# Altium project Prototype_1.PrjPcb (part 2 of 2)
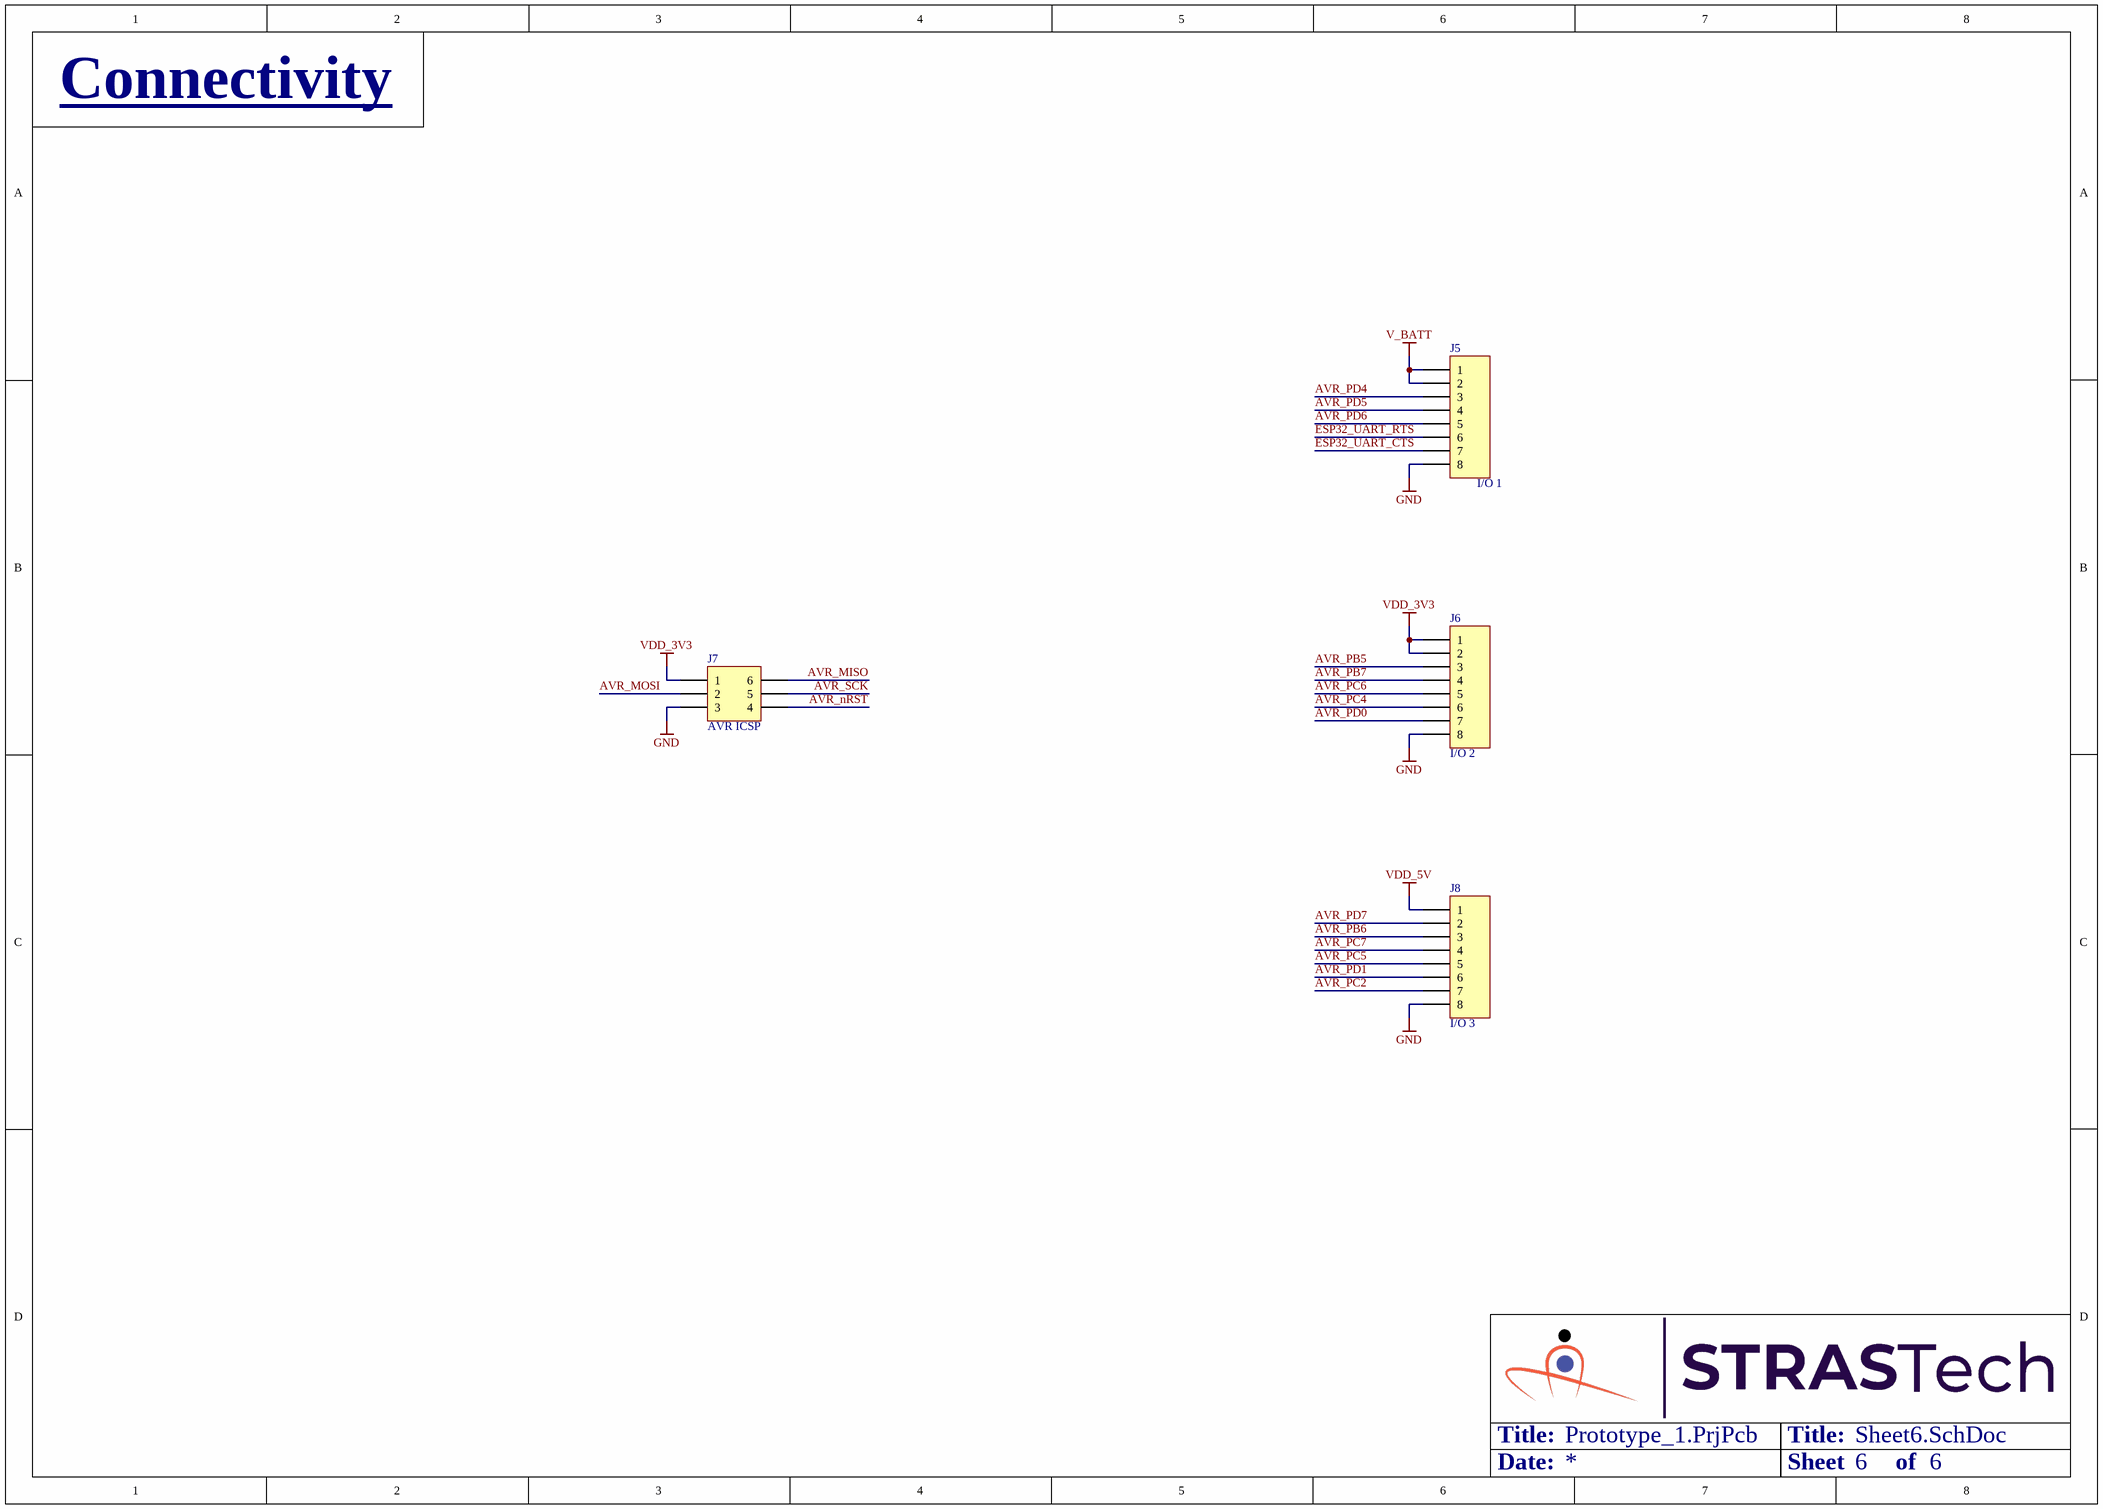
[diagram p6: Sheet6.SchDoc]

## Nets that join several sheets
A_GND: Sheet3 (24 pins), Sheet4 (C50.2)
GND: Sheet1 (25 pins), Sheet2 (23 pins), Sheet3 (20 pins), Sheet4 (26 pins), Sheet5 (13 pins), Sheet6 (J5.8 J6.8 J7.3 J8.8)
USB_VBUS: Sheet2 (Q1.2 Q2.2 Q4.2), Sheet4 (Q7.2 R60.2 TP46.1)
V_BATT: Sheet4 (6 pins), Sheet5 (7 pins), Sheet6 (J5.1 J5.2)
VDD_3V3: Sheet1 (24 pins), Sheet3 (17 pins), Sheet4 (6 pins), Sheet6 (J6.1 J6.2 J7.1)
VDD_5V: Sheet4 (13 pins), Sheet6 (J8.1)
VDD_5VA: Sheet3 (12 pins), Sheet4 (C50.1 R70.2 TP53.1)
AVR_MISO: Sheet5 (U14.17), Sheet6 (J7.6)
AVR_MOSI: Sheet5 (U14.16), Sheet6 (J7.2)
AVR_nRST: Sheet5 (5 pins), Sheet6 (J7.4)
AVR_PB5: Sheet5 (U14.19), Sheet6 (J6.3)
AVR_PB6: Sheet5 (U14.20), Sheet6 (J8.3)
AVR_PB7: Sheet5 (U14.21), Sheet6 (J6.4)
AVR_PC2: Sheet5 (U14.5), Sheet6 (J8.7)
AVR_PC4: Sheet5 (U14.26), Sheet6 (J6.6)
AVR_PC5: Sheet5 (U14.25), Sheet6 (J8.5)
AVR_PC6: Sheet5 (U14.23), Sheet6 (J6.5)
AVR_PC7: Sheet5 (U14.22), Sheet6 (J8.4)
AVR_PD0: Sheet5 (U14.6), Sheet6 (J6.7)
AVR_PD1: Sheet5 (U14.7), Sheet6 (J8.6)
AVR_PD4: Sheet5 (U14.10), Sheet6 (J5.3)
AVR_PD5: Sheet5 (U14.11), Sheet6 (J5.4)
AVR_PD6: Sheet5 (U14.12), Sheet6 (J5.5)
AVR_PD7: Sheet5 (U14.13), Sheet6 (J8.2)
AVR_SCK: Sheet5 (U14.15), Sheet6 (J7.5)
CHG_EN: Sheet4 (Q7.1 R60.1 TP48.1), Sheet5 (U14.18)
ESP32_UART_CTS: Sheet2 (U4.15), Sheet6 (J5.7)
ESP32_UART_RTS: Sheet2 (U4.16), Sheet6 (J5.6)
ESP32_UART_RXD: Sheet1 (R1.1 TP2.1 U1.50), Sheet2 (R17.2)
ESP32_UART_TXD: Sheet1 (R2.2 TP1.1), Sheet2 (R14.2)
ESP32_USB_N: Sheet2 (R21.2), Sheet3 (U1.18)
ESP32_USB_P: Sheet2 (R20.2), Sheet3 (U1.19)
MAIN_PWR_EN: Sheet4 (Q8.1 R65.1 TP52.1), Sheet5 (U14.14)
UART_ESP32RX_AVRTX: Sheet3 (R3.2 TP8.1), Sheet5 (U14.9)
UART_ESP32TX_AVRRX: Sheet3 (TP7.1 U1.23), Sheet5 (R72.2)